# EasyEDA schematic SHC_amp_fuzz.json
TITLE: Sheet_1; REV: 1.0; Date: 2024-06-10; Sheet: 1/1; Company: Your Company
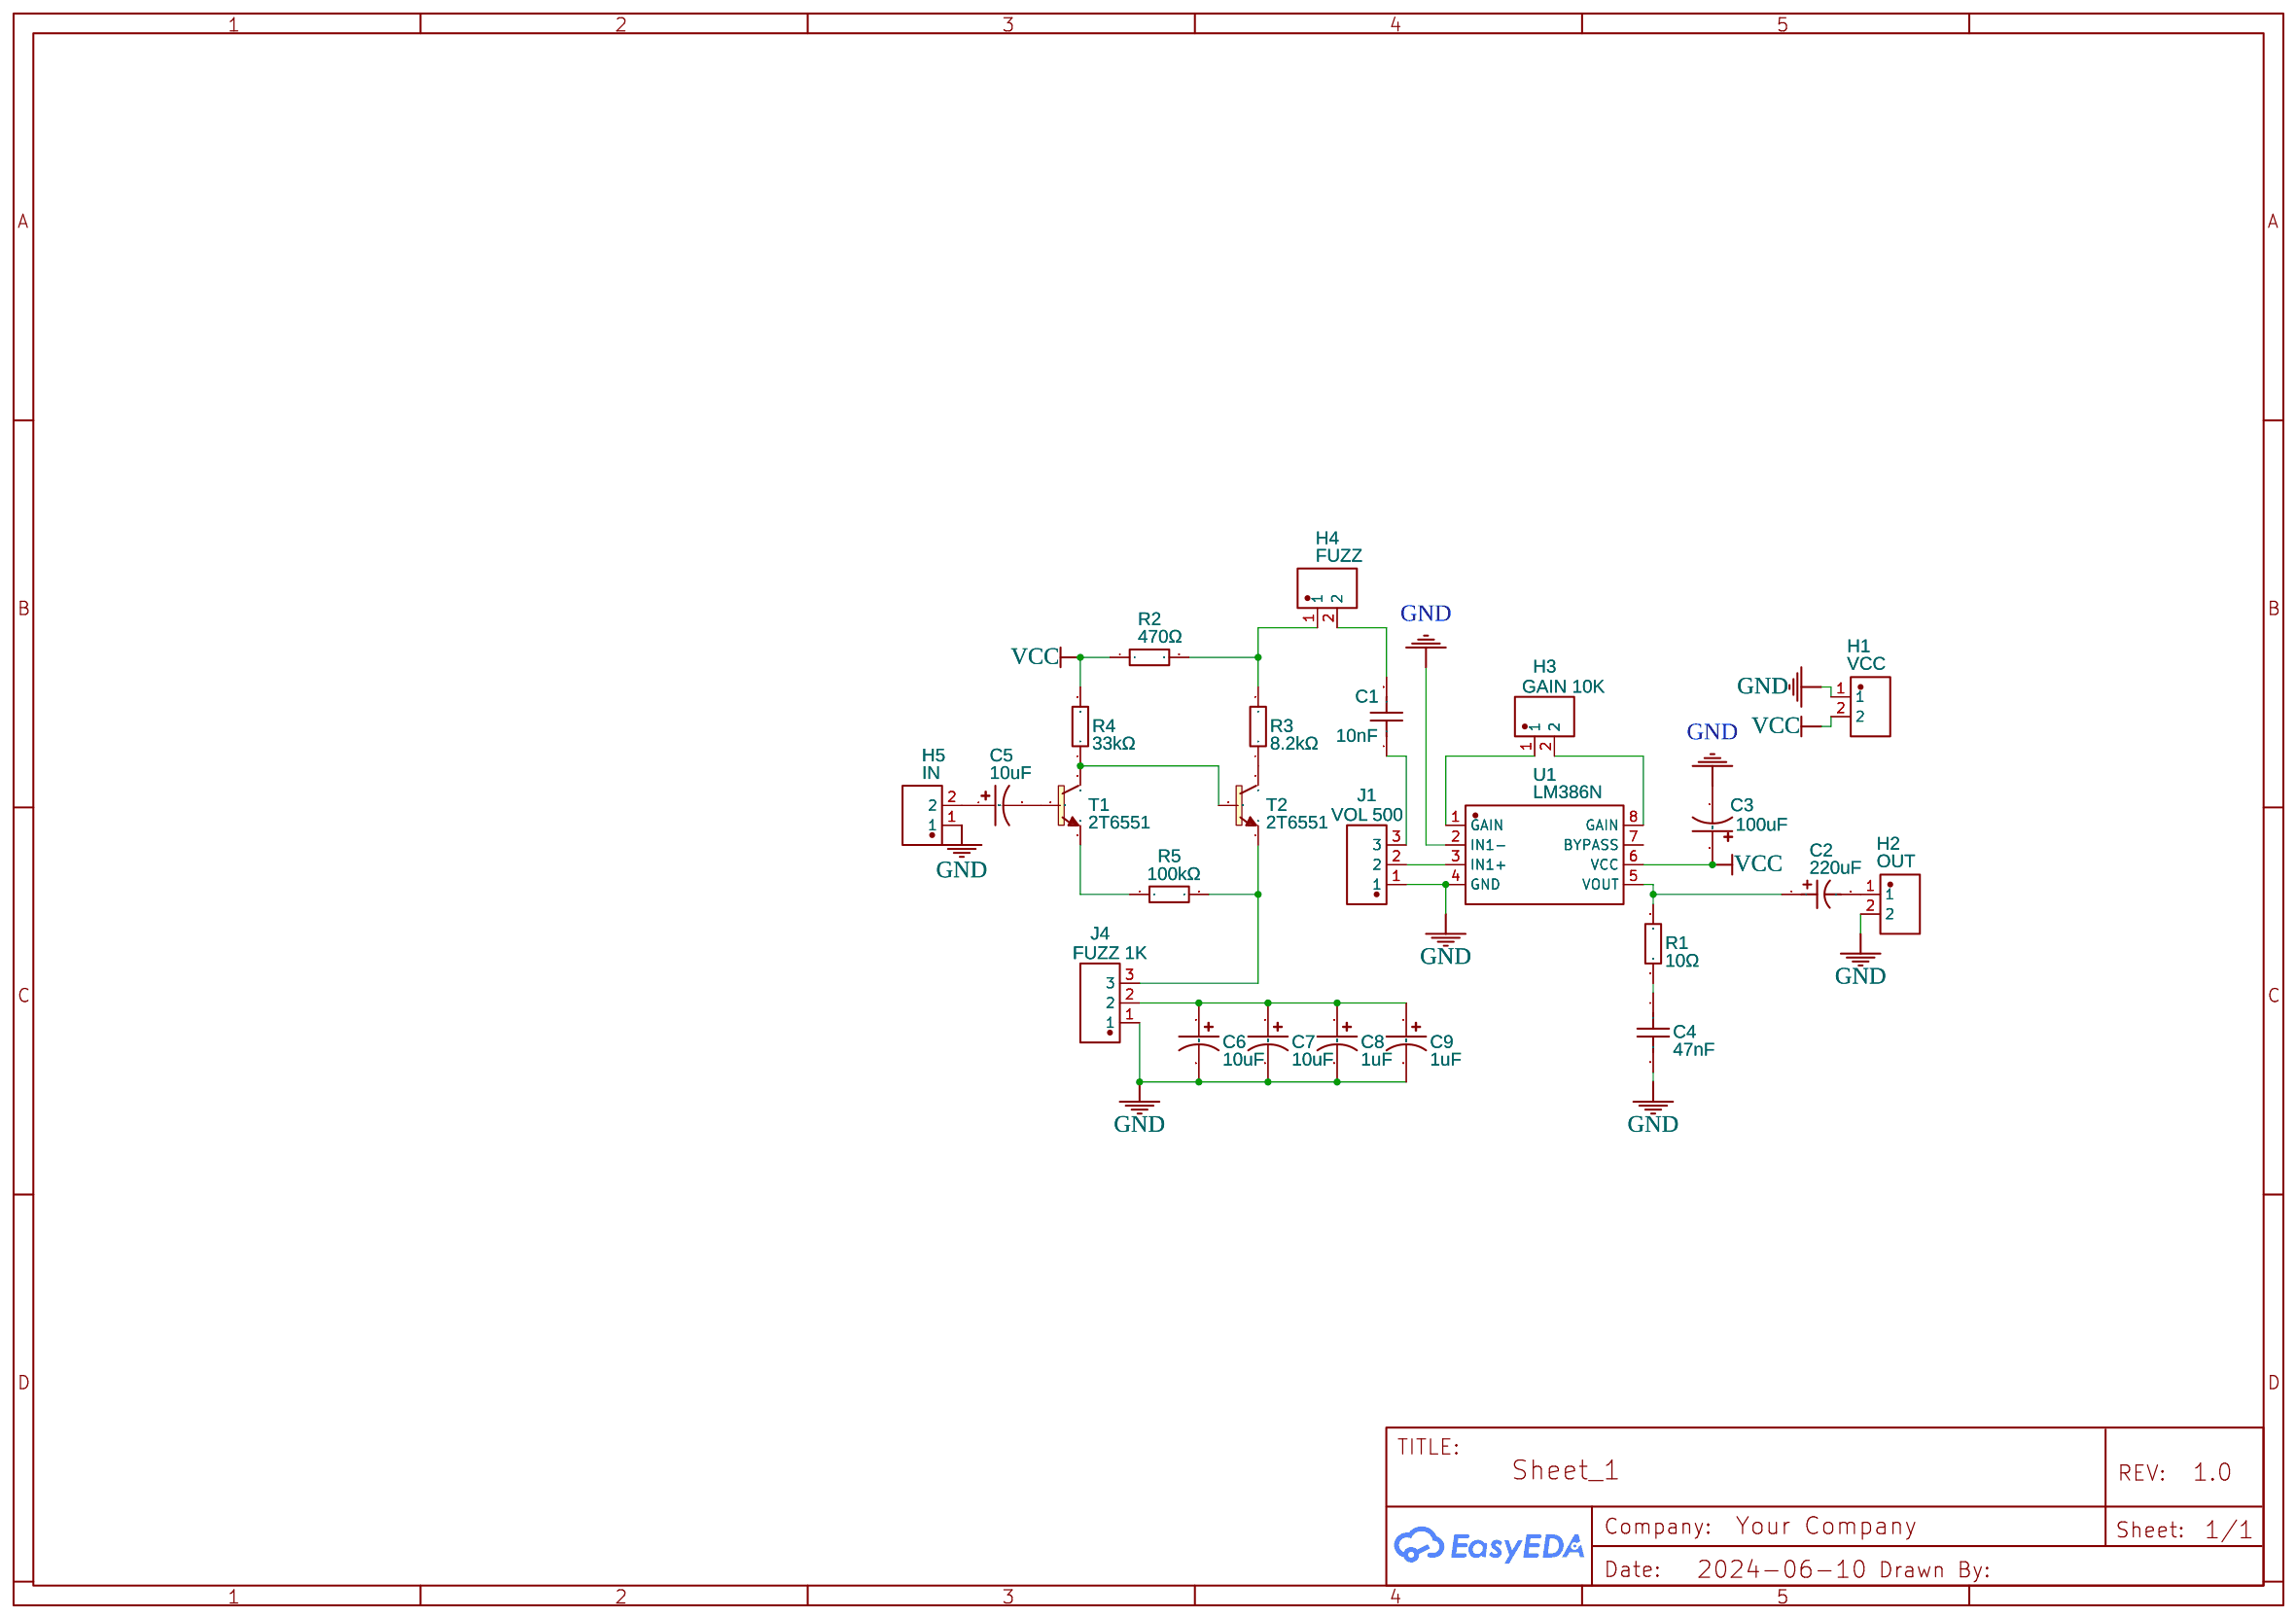
[diagram p0: schematic sheet]

## Parts
C1  10nF  [CAP-TH_L5.0-W2.5-P2.54-D0.7]
C2  220uF  [CAP-TH_BD8.0-P3.50-D0.5-FD]
C3  100uF  [CAP-TH_BD6.3-P2.50-D1.0-FD]
C4  47nF  [CAP-TH_L5.0-W2.5-P2.54-D0.7]
C5  10uF  [CAP-TH_BD5.0-P2.00-D0.5-FD]
C6  10uF  [CAP-TH_BD5.0-P2.00-D0.5-FD]
C7  10uF  [CAP-TH_BD5.0-P2.00-D0.5-FD]
C8  1uF  [CAP-TH_BD5.0-P2.00-D0.5-FD]
C9  1uF  [CAP-TH_BD5.0-P2.00-D0.5-FD]
H1  VCC  [HDR-TH_2P-P2.00-V-F]
H2  OUT  [HDR-TH_2P-P2.00-V-F]
H3  GAIN 10K  [HDR-TH_2P-P2.00-V-F]
H4  FUZZ  [HDR-TH_2P-P2.00-V-F]
H5  IN  [HDR-TH_2P-P2.00-V-F]
J1  VOL 500  [HDR-TH_3P-P2.54-V-F]
J4  FUZZ 1K  [HDR-TH_3P-P2.54-V-F]
R1  10Ω  [RES-TH_BD4.0-L11.5-P15.50-D0.7]
R2  470Ω  [RES-TH_BD2.3-L6.5-P10.50-D0.5]
R3  8.2kΩ  [RES-TH_BD2.3-L6.5-P10.50-D0.5]
R4  33kΩ  [RES-TH_BD2.3-L6.5-P10.50-D0.5]
R5  100kΩ  [RES-TH_BD2.3-L6.5-P10.50-D0.5]
T1  2T6551  [TO5]
T2  2T6551  [TO5]
U1  LM386N  [DIP-8_L9.7-W6.4-P2.54-LS7.6-BL]

## Library data of the parts
C1 C4 = CC1H104ZA1PD3F5P3003: Contributor: LCSC; Supplier: LCSC; Supplier Part: C353903; Manufacturer: Dersonic(德尔创); JLCPCB Part Class: Extended Part
C2 = 16V470UF CD110: Contributor: LCSC; Supplier: LCSC; Supplier Part: C2960230; Manufacturer: HRK(鸿瑞凯电子); Manufacturer Part: 16V470uF CD110; JLCPCB Part Class: Extended Part
C3 = LKMC2001J101MF: Contributor: LCSC; Supplier: LCSC; Supplier Part: C442931; Manufacturer: Ymin(永铭); JLCPCB Part Class: Extended Part
C5-C9 = 16V100UF CD288_C2960368: Contributor: lcsc; Supplier: LCSC; Supplier Part: C2960368; Manufacturer: HRK(鸿瑞凯电子); Manufacturer Part: 16V100uF CD288; JLCPCB Part Class: Extended Part
H1-H5 = 2RS1-02-G: Supplier: LCSC; Supplier Part: C6380302; Manufacturer: ADAM TECH; JLCPCB Part Class: Extended Part; Contributor: lcsc
J1 J4 = 5-535541-1: Supplier: LCSC; Supplier Part: C6688901; Manufacturer: TE Connectivity(泰科电子); Contributor: lcsc; JLCPCB Part Class: Extended Part
R1 = CF1W-360Ω±5% T: Contributor: LCSC; Supplier: LCSC; Supplier Part: C120404; Manufacturer: CCO(千志电子); JLCPCB Part Class: Extended Part
R2-R5 = CF1/4W-110KΩ±5% T52: Contributor: LCSC; Supplier: LCSC; Supplier Part: C120104; Manufacturer: CCO(千志电子); JLCPCB Part Class: Extended Part
T1 T2 = *-NPN-TO5: Contributor: mjuwillie
U1 = LM386N: Contributor: LCSC; Supplier: LCSC; Supplier Part: C510561; Manufacturer: HTC; JLCPCB Part Class: Extended Part

## Nets
GND: C3.2 C4.2 C6.2 C7.2 C8.2 C9.2 H1.1 H2.2 H5.1 J1.1 J4.1 U1.2(IN1-) U1.4(GND)
VCC: C3.1 H1.2 R2.1 R4.2 U1.6(VCC)
Net-(C1-1): C1.1 J1.3
Net-(C1-2): C1.2 H4.2
Net-(C2-1): C2.1 R1.2 U1.5(VOUT)
Net-(C2-2): C2.2 H2.1
Net-(C4-1): C4.1 R1.1
Net-(C5-1): C5.1 H5.2
Net-(C5-2): C5.2 T1.2(B)
Net-(C6-1): C6.1 C7.1 C8.1 C9.1 J4.2
Net-(H3-1): H3.1 U1.1(GAIN)
Net-(H3-2): H3.2 U1.8(GAIN)
Net-(H4-1): H4.1 R2.2 R3.2
Net-(J1-2): J1.2 U1.3(IN1+)
Net-(J4-3): J4.3 R5.2 T2.1(E)
Net-(R3-1): R3.1 T2.3(C)
Net-(R4-1): R4.1 T1.3(C) T2.2(B)
Net-(R5-1): R5.1 T1.1(E)

Not connected (* = marked no-connect by the designer): U1 7(BYPASS)
